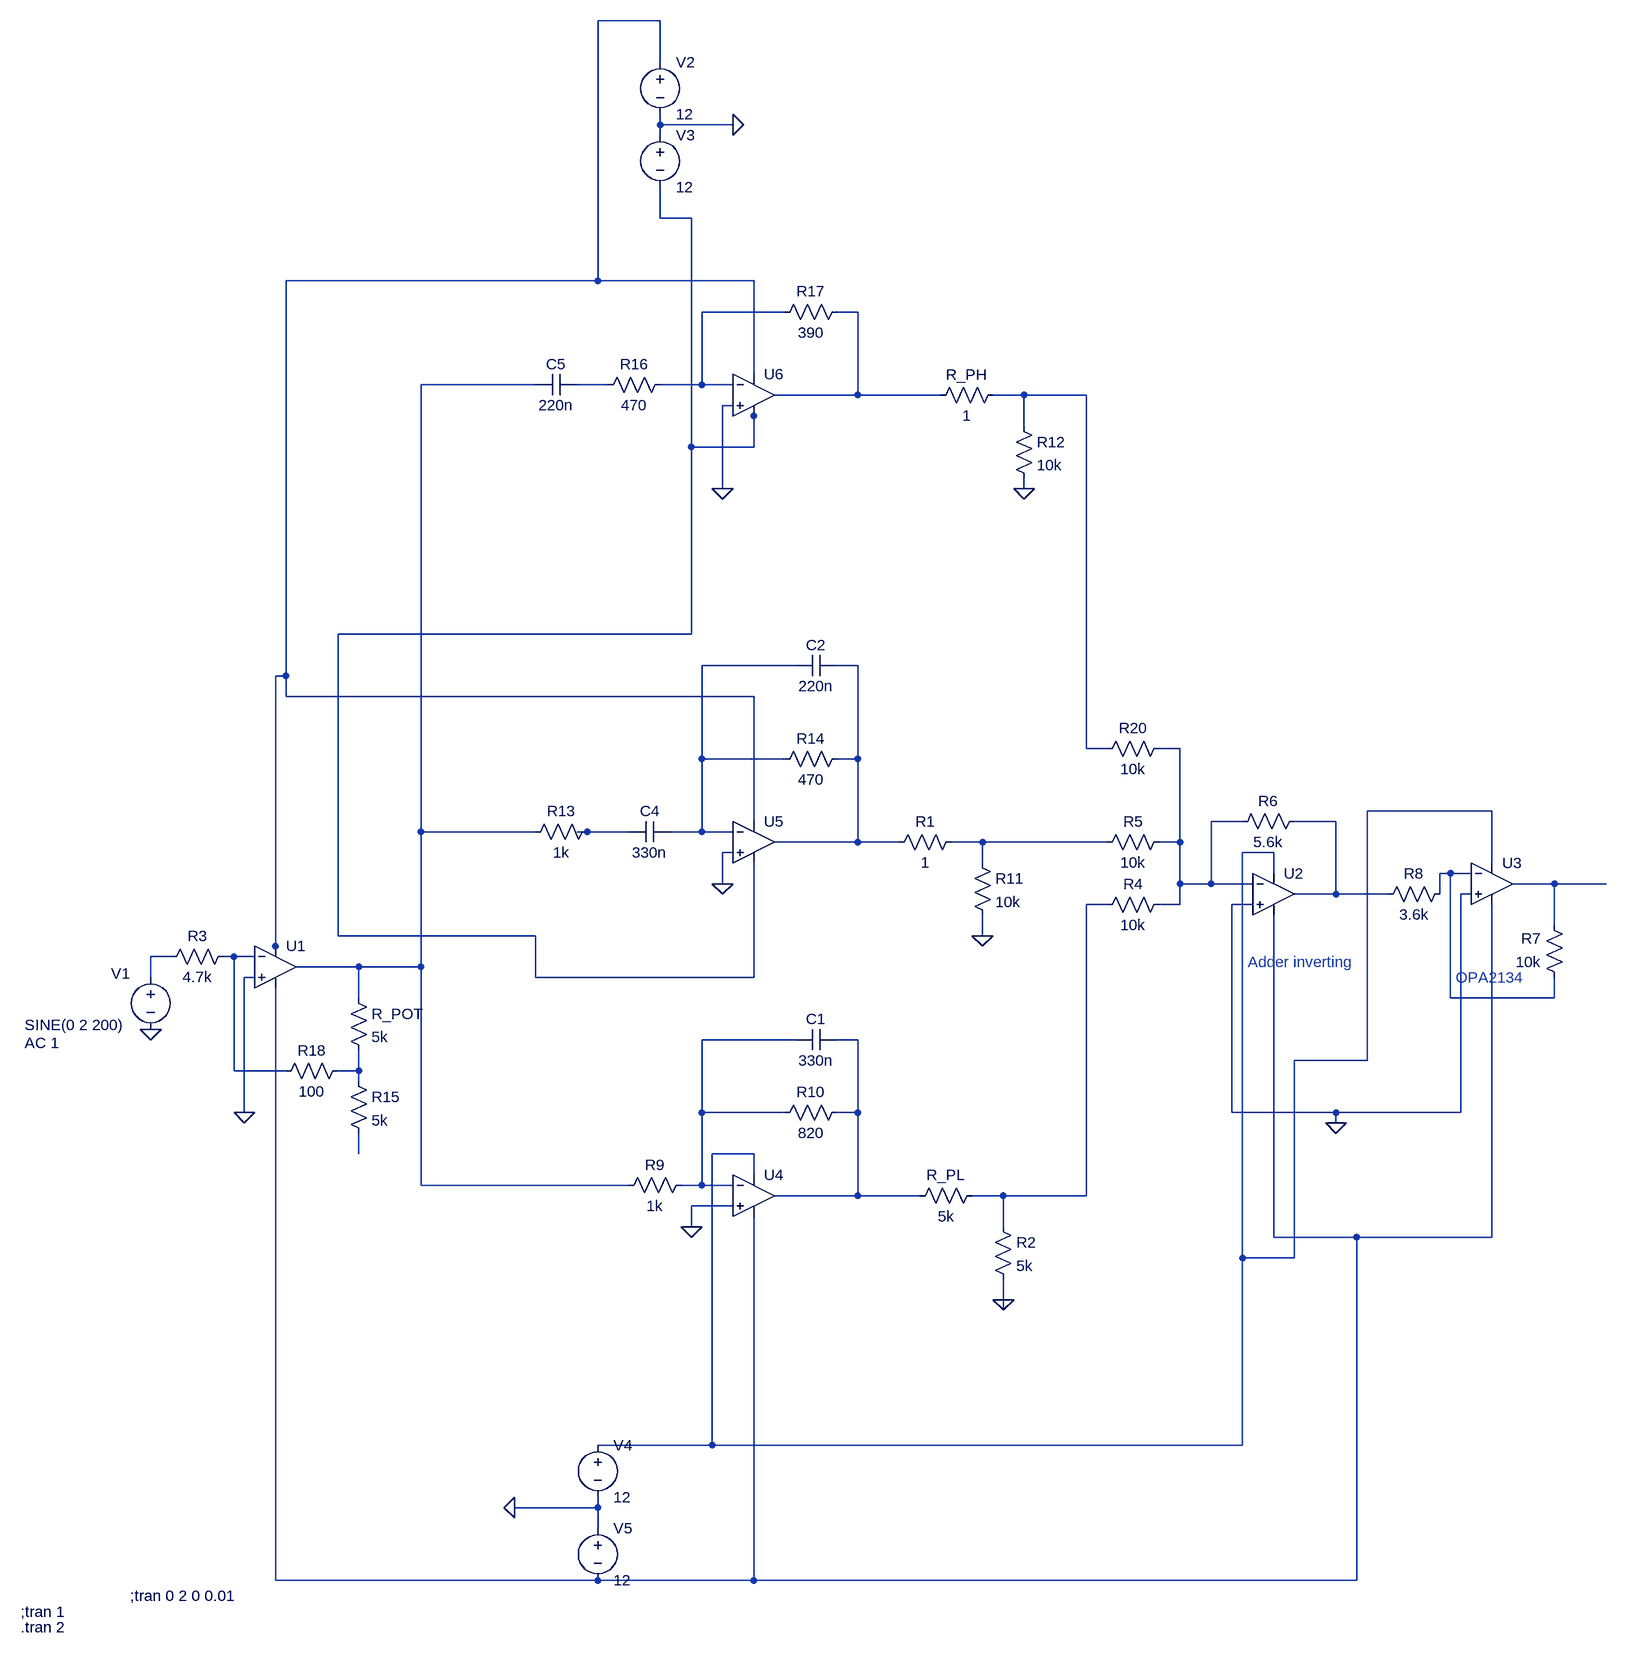
[diagram p0: schematic Amplifier project LtSpice.asc]
Amplifier project LtSpice.asc, the LTspice schematic file:
Version 4
SHEET 1 1940 1272
WIRE -112 -1216 -208 -1216
WIRE -112 -1152 -112 -1216
WIRE -112 -1056 -112 -1072
WIRE 0 -1056 -112 -1056
WIRE -112 -1040 -112 -1056
WIRE -112 -912 -112 -960
WIRE -64 -912 -112 -912
WIRE -208 -816 -208 -1216
WIRE -208 -816 -688 -816
WIRE 32 -816 -208 -816
WIRE 80 -768 -48 -768
WIRE 192 -768 160 -768
WIRE 32 -672 32 -816
WIRE -304 -656 -480 -656
WIRE -192 -656 -240 -656
WIRE -48 -656 -48 -768
WIRE -48 -656 -112 -656
WIRE 0 -656 -48 -656
WIRE 192 -640 192 -768
WIRE 192 -640 64 -640
WIRE 320 -640 192 -640
WIRE 448 -640 400 -640
WIRE 544 -640 448 -640
WIRE 0 -624 -16 -624
WIRE 32 -608 32 -624
WIRE 448 -592 448 -640
WIRE -64 -560 -64 -912
WIRE 32 -560 32 -608
WIRE 32 -560 -64 -560
WIRE -16 -496 -16 -624
WIRE 448 -496 448 -512
WIRE -64 -272 -64 -560
WIRE -64 -272 -608 -272
WIRE 96 -224 -48 -224
WIRE 192 -224 160 -224
WIRE -688 -208 -688 -816
WIRE -688 -208 -704 -208
WIRE -688 -176 -688 -208
WIRE 32 -176 -688 -176
WIRE 544 -96 544 -640
WIRE 576 -96 544 -96
WIRE 688 -96 656 -96
WIRE -48 -80 -48 -224
WIRE 80 -80 -48 -80
WIRE 192 -80 192 -224
WIRE 192 -80 160 -80
WIRE 1168 0 976 0
WIRE 32 16 32 -176
WIRE 784 16 736 16
WIRE 928 16 864 16
WIRE -480 32 -480 -656
WIRE -304 32 -480 32
WIRE -224 32 -240 32
WIRE -160 32 -224 32
WIRE -48 32 -48 -80
WIRE -48 32 -96 32
WIRE 0 32 -48 32
WIRE 192 48 192 -80
WIRE 192 48 64 48
WIRE 256 48 192 48
WIRE 384 48 336 48
WIRE 576 48 384 48
WIRE 688 48 688 -96
WIRE 688 48 656 48
WIRE 0 64 -16 64
WIRE 832 64 784 64
WIRE 384 80 384 48
WIRE 1168 80 1168 0
WIRE 832 96 832 64
WIRE 1104 96 1088 96
WIRE 1136 96 1104 96
WIRE -16 112 -16 64
WIRE 688 112 688 48
WIRE 736 112 736 16
WIRE 736 112 688 112
WIRE 800 112 736 112
WIRE 1264 112 1200 112
WIRE 1344 112 1264 112
WIRE 928 128 928 16
WIRE 928 128 864 128
WIRE 1008 128 928 128
WIRE 1088 128 1088 96
WIRE 1136 128 1120 128
WIRE 576 144 544 144
WIRE 688 144 688 112
WIRE 688 144 656 144
WIRE 800 144 768 144
WIRE 1264 176 1264 112
WIRE -608 192 -608 -272
WIRE -304 192 -608 192
WIRE 384 192 384 160
WIRE -704 208 -704 -208
WIRE -864 224 -896 224
WIRE -768 224 -784 224
WIRE -736 224 -768 224
WIRE -704 224 -704 208
WIRE -576 240 -672 240
WIRE -480 240 -480 32
WIRE -480 240 -576 240
WIRE -896 256 -896 224
WIRE -736 256 -752 256
WIRE -304 256 -304 192
WIRE 32 256 32 80
WIRE 32 256 -304 256
WIRE -576 288 -576 240
WIRE 1104 288 1104 96
WIRE 1264 288 1264 256
WIRE 1264 288 1104 288
WIRE 96 352 -48 352
WIRE 192 352 160 352
WIRE 976 384 976 0
WIRE 976 384 864 384
WIRE -768 400 -768 224
WIRE -688 400 -768 400
WIRE -576 400 -576 368
WIRE -576 400 -608 400
WIRE -576 416 -576 400
WIRE -752 464 -752 256
WIRE -48 464 -48 352
WIRE 80 464 -48 464
WIRE 192 464 192 352
WIRE 192 464 160 464
WIRE 768 464 768 144
WIRE 928 464 768 464
WIRE 1120 464 1120 128
WIRE 1120 464 928 464
WIRE 928 480 928 464
WIRE -576 528 -576 496
WIRE 32 528 -32 528
WIRE 32 560 32 528
WIRE -480 576 -480 240
WIRE -160 576 -480 576
WIRE -48 576 -48 464
WIRE -48 576 -80 576
WIRE 0 576 -48 576
WIRE 192 592 192 464
WIRE 192 592 64 592
WIRE 288 592 192 592
WIRE 416 592 368 592
WIRE 544 592 544 144
WIRE 544 592 416 592
WIRE 0 608 -64 608
WIRE -64 640 -64 608
WIRE 416 640 416 592
WIRE 832 656 832 160
WIRE 960 656 832 656
WIRE 1168 656 1168 144
WIRE 1168 656 960 656
WIRE 784 688 784 64
WIRE 864 688 864 384
WIRE 864 688 784 688
WIRE 416 752 416 720
WIRE 416 768 416 752
WIRE -32 976 -32 528
WIRE -32 976 -208 976
WIRE 784 976 784 688
WIRE 784 976 -32 976
WIRE -208 1072 -208 1056
WIRE -208 1072 -336 1072
WIRE -208 1104 -208 1072
WIRE -704 1184 -704 272
WIRE -208 1184 -704 1184
WIRE 32 1184 32 624
WIRE 32 1184 -208 1184
WIRE 960 1184 960 656
WIRE 960 1184 32 1184
FLAG -64 640 0
FLAG -896 336 0
FLAG 0 -1056 0
FLAG -336 1072 0
FLAG 928 480 0
FLAG -752 464 0
FLAG -16 112 0
FLAG -16 -496 0
FLAG 448 -496 0
FLAG 384 192 0
FLAG 416 752 0
SYMBOL Opamps\\UniversalOpamp2 -704 240 R0
SYMATTR InstName U1
SYMBOL res -592 272 R0
SYMATTR InstName R_POT
SYMATTR Value 5k
SYMBOL res -768 208 R90
WINDOW 0 0 56 VBottom 2
WINDOW 3 32 56 VTop 2
SYMATTR InstName R3
SYMATTR Value 4.7k
SYMBOL voltage -896 240 R0
WINDOW 123 -194 117 Left 2
WINDOW 39 0 0 Left 2
WINDOW 0 -61 10 Left 2
WINDOW 3 -194 89 Left 2
SYMATTR Value2 AC 1
SYMATTR InstName V1
SYMATTR Value SINE(0 2 200)
SYMBOL voltage -112 -1168 R0
WINDOW 123 0 0 Left 2
WINDOW 39 0 0 Left 2
SYMATTR InstName V2
SYMATTR Value 12
SYMBOL voltage -112 -1056 R0
WINDOW 123 0 0 Left 2
WINDOW 39 0 0 Left 2
SYMATTR InstName V3
SYMATTR Value 12
SYMBOL voltage -208 960 R0
WINDOW 123 0 0 Left 2
WINDOW 39 0 0 Left 2
SYMATTR InstName V4
SYMATTR Value 12
SYMBOL voltage -208 1088 R0
WINDOW 123 0 0 Left 2
WINDOW 39 0 0 Left 2
SYMATTR InstName V5
SYMATTR Value 12
SYMBOL Opamps\\UniversalOpamp2 832 128 R0
SYMATTR InstName U2
SYMBOL res 672 128 R90
WINDOW 0 0 56 VBottom 2
WINDOW 3 32 56 VTop 2
SYMATTR InstName R4
SYMATTR Value 10k
SYMBOL res 672 32 R90
WINDOW 0 0 56 VBottom 2
WINDOW 3 32 56 VTop 2
SYMATTR InstName R5
SYMATTR Value 10k
SYMBOL res 768 32 R270
WINDOW 0 32 56 VTop 2
WINDOW 3 0 56 VBottom 2
SYMATTR InstName R6
SYMATTR Value 5.6k
SYMBOL Opamps\\UniversalOpamp2 1168 112 R0
SYMATTR InstName U3
SYMBOL res 1280 272 R180
WINDOW 0 36 76 Left 2
WINDOW 3 36 40 Left 2
SYMATTR InstName R7
SYMATTR Value 10k
SYMBOL res 992 144 R270
WINDOW 0 32 56 VTop 2
WINDOW 3 0 56 VBottom 2
SYMATTR InstName R8
SYMATTR Value 3.6k
SYMBOL Opamps\\UniversalOpamp2 32 592 R0
SYMATTR InstName U4
SYMBOL res -64 560 R90
WINDOW 0 0 56 VBottom 2
WINDOW 3 32 56 VTop 2
SYMATTR InstName R9
SYMATTR Value 1k
SYMBOL res 176 448 R90
WINDOW 0 0 56 VBottom 2
WINDOW 3 32 56 VTop 2
SYMATTR InstName R10
SYMATTR Value 820
SYMBOL Opamps\\UniversalOpamp2 32 48 R0
SYMATTR InstName U5
SYMBOL res -208 16 R90
WINDOW 0 0 56 VBottom 2
WINDOW 3 32 56 VTop 2
SYMATTR InstName R13
SYMATTR Value 1k
SYMBOL res 176 -96 R90
WINDOW 0 0 56 VBottom 2
WINDOW 3 32 56 VTop 2
SYMATTR InstName R14
SYMATTR Value 470
SYMBOL cap -96 16 R90
WINDOW 0 0 32 VBottom 2
WINDOW 3 32 32 VTop 2
SYMATTR InstName C4
SYMATTR Value 330n
SYMBOL Opamps\\UniversalOpamp2 32 -640 R0
SYMATTR InstName U6
SYMBOL res -96 -672 R90
WINDOW 0 0 56 VBottom 2
WINDOW 3 32 56 VTop 2
SYMATTR InstName R16
SYMATTR Value 470
SYMBOL res 176 -784 R90
WINDOW 0 0 56 VBottom 2
WINDOW 3 32 56 VTop 2
SYMATTR InstName R17
SYMATTR Value 390
SYMBOL cap -240 -672 R90
WINDOW 0 0 32 VBottom 2
WINDOW 3 32 32 VTop 2
SYMATTR InstName C5
SYMATTR Value 220n
SYMBOL res 672 -112 R90
WINDOW 0 0 56 VBottom 2
WINDOW 3 32 56 VTop 2
SYMATTR InstName R20
SYMATTR Value 10k
SYMBOL cap 160 336 R90
WINDOW 0 0 32 VBottom 2
WINDOW 3 32 32 VTop 2
SYMATTR InstName C1
SYMATTR Value 330n
SYMBOL res 384 576 R90
WINDOW 0 0 56 VBottom 2
WINDOW 3 32 56 VTop 2
SYMATTR InstName R_PL
SYMATTR Value 5k
SYMBOL res 416 -656 R90
WINDOW 0 0 56 VBottom 2
WINDOW 3 32 56 VTop 2
SYMATTR InstName R_PH
SYMATTR Value 1
SYMBOL cap 160 -240 R90
WINDOW 0 0 32 VBottom 2
WINDOW 3 32 32 VTop 2
SYMATTR InstName C2
SYMATTR Value 220n
SYMBOL res 352 32 R90
WINDOW 0 0 56 VBottom 2
WINDOW 3 32 56 VTop 2
SYMATTR InstName R1
SYMATTR Value 1
SYMBOL res 400 624 R0
SYMATTR InstName R2
SYMATTR Value 5k
SYMBOL res 368 64 R0
SYMATTR InstName R11
SYMATTR Value 10k
SYMBOL res 432 -608 R0
SYMATTR InstName R12
SYMATTR Value 10k
SYMBOL res -592 400 R0
SYMATTR InstName R15
SYMATTR Value 5k
SYMBOL res -592 384 R90
WINDOW 0 0 56 VBottom 2
WINDOW 3 32 56 VTop 2
SYMATTR InstName R18
SYMATTR Value 100
TEXT -928 1208 Left 2 !;tran 0 2 0 0.01
TEXT 1112 256 Left 2 ;OPA2134
TEXT 792 232 Left 2 ;Adder inverting
TEXT -1096 1232 Left 2 !;tran 1
TEXT -1096 1256 Left 2 !.tran 2

The netlist it stands for:
* Amplifier project LtSpice.asc
XU1 0 N019 N001 N024 N005 level.2 Avol=1Meg GBW=10Meg Slew=10Meg ilimit=25m rail=0 Vos=0 phimargin=45 en=0 enk=0 in=0 ink=0 Rin=500Meg  ; pins IN+ IN- V+ V- OUT
R_POT N005 N022 5k
R3 N019 N018 4.7k
V1 N018 0 SINE(0 2 200) AC 1
V2 N001 0 12
V3 0 N002 12
V4 N011 0 12
V5 0 N024 12
XU2 0 N010 N011 N024 N012 level.2 Avol=1Meg GBW=10Meg Slew=10Meg ilimit=25m rail=0 Vos=0 phimargin=45 en=0 enk=0 in=0 ink=0 Rin=500Meg  ; pins IN+ IN- V+ V- OUT
R4 N010 N017 10k
R5 N010 N014 10k
R6 N010 N012 5.6k
XU3 0 N015 N011 N024 N016 level.2 Avol=1Meg GBW=10Meg Slew=10Meg ilimit=25m rail=0 Vos=0 phimargin=45 en=0 enk=0 in=0 ink=0 Rin=500Meg  ; pins IN+ IN- V+ V- OUT
R7 N015 N016 10k
R8 N012 N015 3.6k
XU4 0 N020 N011 N024 N021 level.2 Avol=1Meg GBW=10Meg Slew=10Meg ilimit=25m rail=0 Vos=0 phimargin=45 en=0 enk=0 in=0 ink=0 Rin=500Meg  ; pins IN+ IN- V+ V- OUT
R9 N020 N005 1k
R10 N021 N020 820
XU5 0 N008 N001 N002 N009 level.2 Avol=1Meg GBW=10Meg Slew=10Meg ilimit=25m rail=0 Vos=0 phimargin=45 en=0 enk=0 in=0 ink=0 Rin=500Meg  ; pins IN+ IN- V+ V- OUT
R13 N013 N005 1k
R14 N009 N008 470
C4 N008 N013 330n
XU6 0 N003 N001 N002 N004 level.2 Avol=1Meg GBW=10Meg Slew=10Meg ilimit=25m rail=0 Vos=0 phimargin=45 en=0 enk=0 in=0 ink=0 Rin=500Meg  ; pins IN+ IN- V+ V- OUT
R16 N003 N006 470
R17 N004 N003 390
C5 N006 N005 220n
R20 N010 N007 10k
C1 N021 N020 330n
R_PL N017 N021 5k
R_PH N007 N004 1
C2 N009 N008 220n
R1 N014 N009 1
R2 N017 0 5k
R11 N014 0 10k
R12 N007 0 10k
R15 N022 N023 5k
R18 N022 N019 100
;tran 0 2 0 0.01
* OPA2134
* Adder inverting
;tran 1
.tran 2
.lib UniversalOpamps2.sub
.backanno
.end